# Altium schematic sheet BMS_Balancing.SchDoc
size 431 x 279 mm; SheetNumber: 5; SheetTotal: 6
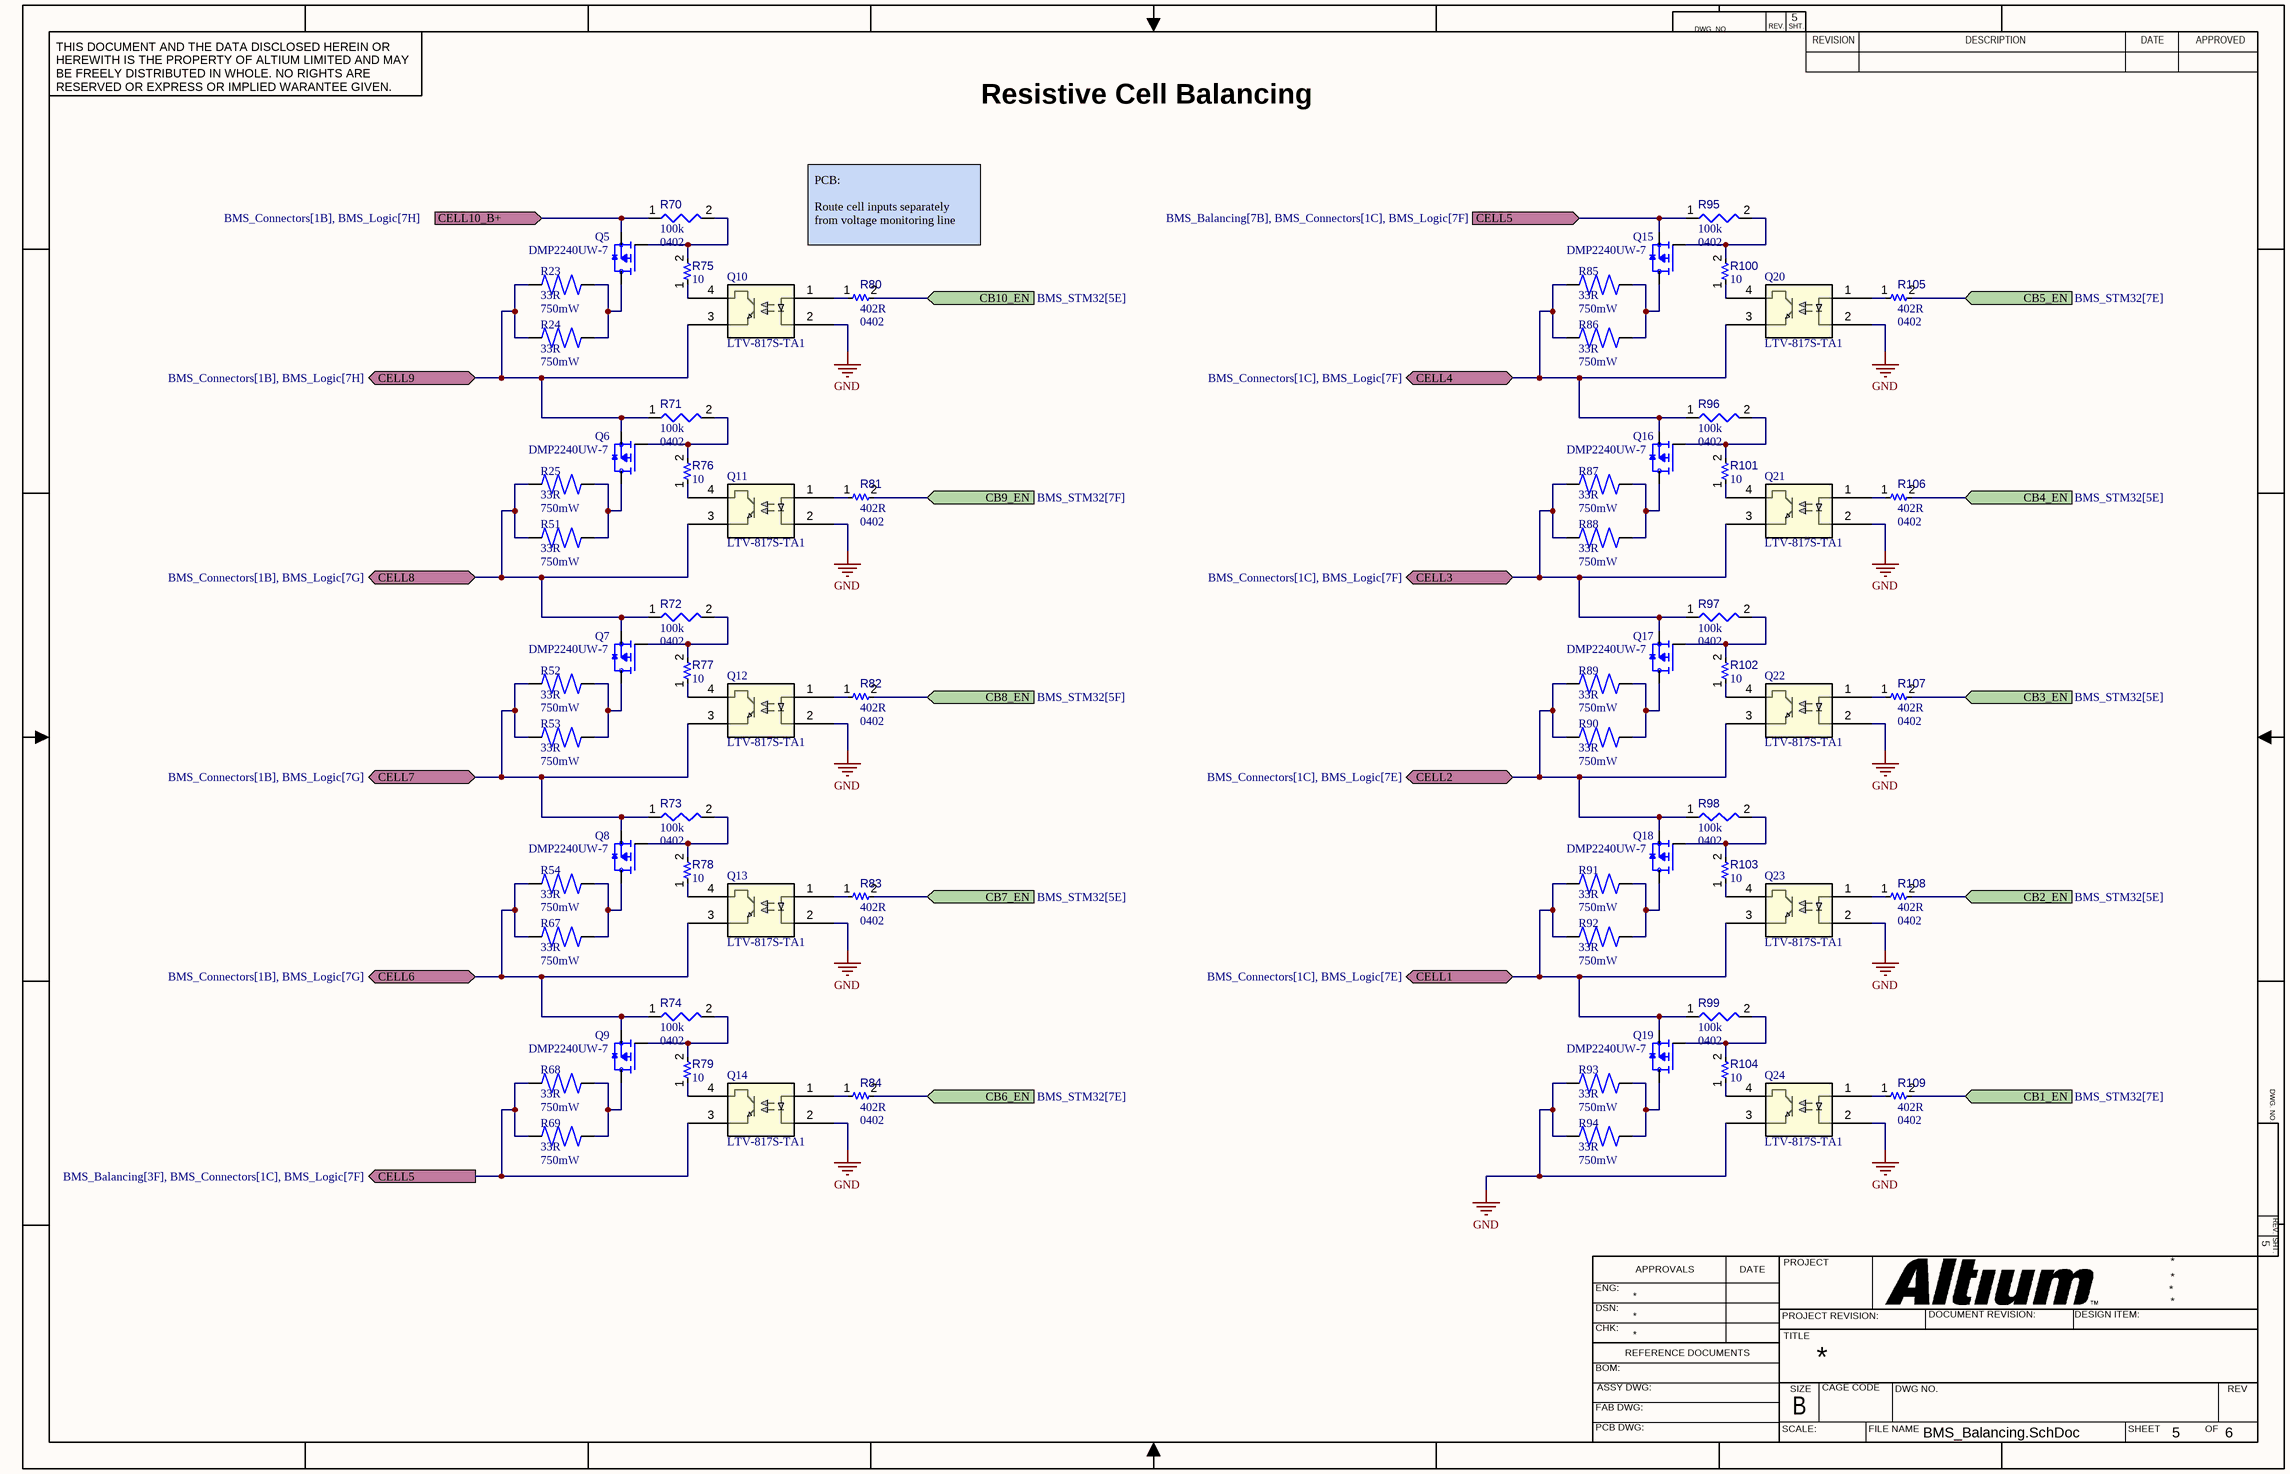
[diagram p0: BMS_Balancing.SchDoc]

## Parts
Q5  DMP2240UW-7  [SOT65P210X110-3N]
Q6  DMP2240UW-7  [SOT65P210X110-3N]
Q7  DMP2240UW-7  [SOT65P210X110-3N]
Q8  DMP2240UW-7  [SOT65P210X110-3N]
Q9  DMP2240UW-7  [SOT65P210X110-3N]
Q10  LTV-817S-TA1  [LTV-817S_LTO]
Q11  LTV-817S-TA1  [LTV-817S_LTO]
Q12  LTV-817S-TA1  [LTV-817S_LTO]
Q13  LTV-817S-TA1  [LTV-817S_LTO]
Q14  LTV-817S-TA1  [LTV-817S_LTO]
Q15  DMP2240UW-7  [SOT65P210X110-3N]
Q16  DMP2240UW-7  [SOT65P210X110-3N]
Q17  DMP2240UW-7  [SOT65P210X110-3N]
Q18  DMP2240UW-7  [SOT65P210X110-3N]
Q19  DMP2240UW-7  [SOT65P210X110-3N]
Q20  LTV-817S-TA1  [LTV-817S_LTO]
Q21  LTV-817S-TA1  [LTV-817S_LTO]
Q22  LTV-817S-TA1  [LTV-817S_LTO]
Q23  LTV-817S-TA1  [LTV-817S_LTO]
Q24  LTV-817S-TA1  [LTV-817S_LTO]
R23  value 33R  Power: 750mW  [RESC1632X70N]  (hidden comment: YAGEO AC0612FR-0733RL)
R24  value 33R  Power: 750mW  [RESC1632X70N]  (hidden comment: YAGEO AC0612FR-0733RL)
R25  value 33R  Power: 750mW  [RESC1632X70N]  (hidden comment: YAGEO AC0612FR-0733RL)
R51  value 33R  Power: 750mW  [RESC1632X70N]  (hidden comment: YAGEO AC0612FR-0733RL)
R52  value 33R  Power: 750mW  [RESC1632X70N]  (hidden comment: YAGEO AC0612FR-0733RL)
R53  value 33R  Power: 750mW  [RESC1632X70N]  (hidden comment: YAGEO AC0612FR-0733RL)
R54  value 33R  Power: 750mW  [RESC1632X70N]  (hidden comment: YAGEO AC0612FR-0733RL)
R67  value 33R  Power: 750mW  [RESC1632X70N]  (hidden comment: YAGEO AC0612FR-0733RL)
R68  value 33R  Power: 750mW  [RESC1632X70N]  (hidden comment: YAGEO AC0612FR-0733RL)
R69  value 33R  Power: 750mW  [RESC1632X70N]  (hidden comment: YAGEO AC0612FR-0733RL)
R70  value 100k  Case/Package: 0402  [RESC0402(1005)_L]  (hidden comment: CRCW0402100KJNED)
R71  value 100k  Case/Package: 0402  [RESC0402(1005)_L]  (hidden comment: CRCW0402100KJNED)
R72  value 100k  Case/Package: 0402  [RESC0402(1005)_L]  (hidden comment: CRCW0402100KJNED)
R73  value 100k  Case/Package: 0402  [RESC0402(1005)_L]  (hidden comment: CRCW0402100KJNED)
R74  value 100k  Case/Package: 0402  [RESC0402(1005)_L]  (hidden comment: CRCW0402100KJNED)
R75  value 10  [RESC0402(1005)_L]  (hidden comment: CL0402FN10RP)
R76  value 10  [RESC0402(1005)_L]  (hidden comment: CL0402FN10RP)
R77  value 10  [RESC0402(1005)_L]  (hidden comment: CL0402FN10RP)
R78  value 10  [RESC0402(1005)_L]  (hidden comment: CL0402FN10RP)
R79  value 10  [RESC0402(1005)_L]  (hidden comment: CL0402FN10RP)
R80  value 402R  Case/Package: 0402  [RESC0402(1005)_L]  (hidden comment: CR0402FF4020G)
R81  value 402R  Case/Package: 0402  [RESC0402(1005)_L]  (hidden comment: CR0402FF4020G)
R82  value 402R  Case/Package: 0402  [RESC0402(1005)_L]  (hidden comment: CR0402FF4020G)
R83  value 402R  Case/Package: 0402  [RESC0402(1005)_L]  (hidden comment: CR0402FF4020G)
R84  value 402R  Case/Package: 0402  [RESC0402(1005)_L]  (hidden comment: CR0402FF4020G)
R85  value 33R  Power: 750mW  [RESC1632X70N]  (hidden comment: YAGEO AC0612FR-0733RL)
R86  value 33R  Power: 750mW  [RESC1632X70N]  (hidden comment: YAGEO AC0612FR-0733RL)
R87  value 33R  Power: 750mW  [RESC1632X70N]  (hidden comment: YAGEO AC0612FR-0733RL)
R88  value 33R  Power: 750mW  [RESC1632X70N]  (hidden comment: YAGEO AC0612FR-0733RL)
R89  value 33R  Power: 750mW  [RESC1632X70N]  (hidden comment: YAGEO AC0612FR-0733RL)
R90  value 33R  Power: 750mW  [RESC1632X70N]  (hidden comment: YAGEO AC0612FR-0733RL)
R91  value 33R  Power: 750mW  [RESC1632X70N]  (hidden comment: YAGEO AC0612FR-0733RL)
R92  value 33R  Power: 750mW  [RESC1632X70N]  (hidden comment: YAGEO AC0612FR-0733RL)
R93  value 33R  Power: 750mW  [RESC1632X70N]  (hidden comment: YAGEO AC0612FR-0733RL)
R94  value 33R  Power: 750mW  [RESC1632X70N]  (hidden comment: YAGEO AC0612FR-0733RL)
R95  value 100k  Case/Package: 0402  [RESC0402(1005)_L]  (hidden comment: CRCW0402100KJNED)
R96  value 100k  Case/Package: 0402  [RESC0402(1005)_L]  (hidden comment: CRCW0402100KJNED)
R97  value 100k  Case/Package: 0402  [RESC0402(1005)_L]  (hidden comment: CRCW0402100KJNED)
R98  value 100k  Case/Package: 0402  [RESC0402(1005)_L]  (hidden comment: CRCW0402100KJNED)
R99  value 100k  Case/Package: 0402  [RESC0402(1005)_L]  (hidden comment: CRCW0402100KJNED)
R100  value 10  [RESC0402(1005)_L]  (hidden comment: CL0402FN10RP)
R101  value 10  [RESC0402(1005)_L]  (hidden comment: CL0402FN10RP)
R102  value 10  [RESC0402(1005)_L]  (hidden comment: CL0402FN10RP)
R103  value 10  [RESC0402(1005)_L]  (hidden comment: CL0402FN10RP)
R104  value 10  [RESC0402(1005)_L]  (hidden comment: CL0402FN10RP)
R105  value 402R  Case/Package: 0402  [RESC0402(1005)_L]  (hidden comment: CR0402FF4020G)
R106  value 402R  Case/Package: 0402  [RESC0402(1005)_L]  (hidden comment: CR0402FF4020G)
R107  value 402R  Case/Package: 0402  [RESC0402(1005)_L]  (hidden comment: CR0402FF4020G)
R108  value 402R  Case/Package: 0402  [RESC0402(1005)_L]  (hidden comment: CR0402FF4020G)
R109  value 402R  Case/Package: 0402  [RESC0402(1005)_L]  (hidden comment: CR0402FF4020G)

## Ports
CB1_EN (in, see BMS_STM32[7E]), CB2_EN (in, see BMS_STM32[5E]), CB3_EN (in, see BMS_STM32[5E]), CB4_EN (in, see BMS_STM32[5E]), CB5_EN (in, see BMS_STM32[7E]), CB6_EN (in, see BMS_STM32[7E]), CB7_EN (in, see BMS_STM32[5E]), CB8_EN (in, see BMS_STM32[5F]), CB9_EN (in, see BMS_STM32[7F]), CB10_EN (in, see BMS_STM32[5E]), CELL1 (bidir, see BMS_Connectors[1C], BMS_Logic[7E]), CELL2 (bidir, see BMS_Connectors[1C], BMS_Logic[7E]), CELL3 (bidir, see BMS_Connectors[1C], BMS_Logic[7F]), CELL4 (bidir, see BMS_Connectors[1C], BMS_Logic[7F]), CELL5 (in, see BMS_Balancing[7B], BMS_Connectors[1C], BMS_Logic[7F]), CELL5 (out, see BMS_Balancing[3F], BMS_Connectors[1C], BMS_Logic[7F]), CELL6 (bidir, see BMS_Connectors[1B], BMS_Logic[7G]), CELL7 (bidir, see BMS_Connectors[1B], BMS_Logic[7G]), CELL8 (bidir, see BMS_Connectors[1B], BMS_Logic[7G]), CELL9 (bidir, see BMS_Connectors[1B], BMS_Logic[7H]), CELL10_B+ (in, see BMS_Connectors[1B], BMS_Logic[7H])

## Nets
GND: Q10.2 Q11.2 Q12.2 Q13.2 Q14.2 Q20.2 Q21.2 Q22.2 Q23.2 Q24.2 Q24.3 R93.1 R94.1
CB1_EN: R109.2 ; port CB1_EN
CB2_EN: R108.2 ; port CB2_EN
CB3_EN: R107.2 ; port CB3_EN
CB4_EN: R106.2 ; port CB4_EN
CB5_EN: R105.2 ; port CB5_EN
CB6_EN: R84.2 ; port CB6_EN
CB7_EN: R83.2 ; port CB7_EN
CB8_EN: R82.2 ; port CB8_EN
CB9_EN: R81.2 ; port CB9_EN
CB10_EN: R80.2 ; port CB10_EN
CELL1: Q19.2(S) Q23.3 R91.1 R92.1 R99.1 ; port CELL1
CELL2: Q18.2(S) Q22.3 R89.1 R90.1 R98.1 ; port CELL2
CELL3: Q17.2(S) Q21.3 R87.1 R88.1 R97.1 ; port CELL3
CELL4: Q16.2(S) Q20.3 R85.1 R86.1 R96.1 ; port CELL4
CELL5: Q14.3 Q15.2(S) R68.1 R69.1 R95.1 ; port CELL5
CELL6: Q9.2(S) Q13.3 R54.1 R67.1 R74.1 ; port CELL6
CELL7: Q8.2(S) Q12.3 R52.1 R53.1 R73.1 ; port CELL7
CELL8: Q7.2(S) Q11.3 R25.1 R51.1 R72.1 ; port CELL8
CELL9: Q6.2(S) Q10.3 R23.1 R24.1 R71.1 ; port CELL9
CELL10_B+: Q5.2(S) R70.1 ; port CELL10_B+
NetQ5_1: Q5.1(G) R70.2 R75.2
NetQ5_3: Q5.3(D) R23.2 R24.2
NetQ6_1: Q6.1(G) R71.2 R76.2
NetQ6_3: Q6.3(D) R25.2 R51.2
NetQ7_1: Q7.1(G) R72.2 R77.2
NetQ7_3: Q7.3(D) R52.2 R53.2
NetQ8_1: Q8.1(G) R73.2 R78.2
NetQ8_3: Q8.3(D) R54.2 R67.2
NetQ9_1: Q9.1(G) R74.2 R79.2
NetQ9_3: Q9.3(D) R68.2 R69.2
NetQ10_1: Q10.1 R80.1
NetQ10_4: Q10.4 R75.1
NetQ11_1: Q11.1 R81.1
NetQ11_4: Q11.4 R76.1
NetQ12_1: Q12.1 R82.1
NetQ12_4: Q12.4 R77.1
NetQ13_1: Q13.1 R83.1
NetQ13_4: Q13.4 R78.1
NetQ14_1: Q14.1 R84.1
NetQ14_4: Q14.4 R79.1
NetQ15_1: Q15.1(G) R95.2 R100.2
NetQ15_3: Q15.3(D) R85.2 R86.2
NetQ16_1: Q16.1(G) R96.2 R101.2
NetQ16_3: Q16.3(D) R87.2 R88.2
NetQ17_1: Q17.1(G) R97.2 R102.2
NetQ17_3: Q17.3(D) R89.2 R90.2
NetQ18_1: Q18.1(G) R98.2 R103.2
NetQ18_3: Q18.3(D) R91.2 R92.2
NetQ19_1: Q19.1(G) R99.2 R104.2
NetQ19_3: Q19.3(D) R93.2 R94.2
NetQ20_1: Q20.1 R105.1
NetQ20_4: Q20.4 R100.1
NetQ21_1: Q21.1 R106.1
NetQ21_4: Q21.4 R101.1
NetQ22_1: Q22.1 R107.1
NetQ22_4: Q22.4 R102.1
NetQ23_1: Q23.1 R108.1
NetQ23_4: Q23.4 R103.1
NetQ24_1: Q24.1 R109.1
NetQ24_4: Q24.4 R104.1

## Notes on the sheet
- Resistive Cell Balancing
- PCB:
  Route cell inputs separately from voltage monitoring line
- DWG. NO.
- REV.
- SHT.
- THIS DOCUMENT AND THE DATA DISCLOSED HEREIN OR HEREWITH IS THE PROPERTY OF ALTIUM LIMITED AND MAY BE FREELY DISTRIBUTED IN WHOLE. NO RIGHTS ARE RESERVED OR EXPRESS OR IMPLIED WARANTEE GIVEN.
- REVISION
- DESCRIPTION
- DATE
- APPROVED
- ENG:
- APPROVALS
- PROJECT
- DSN:
- CHK:
- REFERENCE DOCUMENTS
- PROJECT REVISION:
- TITLE
- DOCUMENT REVISION:
- DESIGN ITEM:
- BOM:
- FAB DWG:
- PCB DWG:
- ASSY DWG:
- SCALE:
- SIZE
- B
- CAGE CODE
- FILE NAME
- DWG NO.
- SHEET
- OF
- REV

## Library data of the parts
Q5-Q9 Q15-Q19 = CMP-147-000000-1: P-Channel Enhancement FET SOT-323; MF: Diodes Inc.; Package: SOT-323 Diodes Inc.; SnapEDA_Link: https://www.snapeda.com/parts/DMP2240UW-7/Diodes+Inc./view-part/?ref=snap; Check_prices: https://www.snapeda.com/parts/DMP2240UW-7/Diodes+Inc./view-part/?ref=eda; Value: *; Pin Count: 3; Source: DMP2240UW-7.SchLib; MP: DMP2240UW-7; Component Type: Standard; Design Item ID: DMP2240UW-7
Q10-Q14 Q20-Q24 = CMP-143-000000-2: No Description Available; Manufacturer_Name: LITE-ON; Source: LTV-817S-TA1.SchLib; RefDes: RefDes; Design Item ID: LTV-817S-TA1; Copyright: Copyright (C) 2025 Ultra Librarian. All rights reserved.; Type: Type; Manufacturer_Part_Number: LTV-817S-TA1
R23-R25 R51-R54 R67-R69 R85-R94 = CMP-009-00178-3: 750 mOhms Â±1% 1W Chip Resistor 0612 (1632 Metric) Automotive AEC-Q200, Current Sense, Moisture Resistant Thick Film; MF: Vishay Dale; Case/Package: 1632 Vishay; SnapEDA_Link: https://www.snapeda.com/parts/RCWE0612R750FKEA/Vishay+Dale/view-part/?ref=snap; Check_prices: https://www.snapeda.com/parts/RCWE0612R750FKEA/Vishay+Dale/view-part/?ref=eda; Source: RCWE0612R750FKEA.SchLib; MP: RCWE0612R750FKEA; Design Item ID: RCWE0612R750FKEA
R70-R74 R95-R99 = CMP-009-00064-2: 100K 0.063W 1% 0402 (1005 Metric)  SMD; Power: 63mW; Mounting Technology: SMT; Pins: 2; Tolerance: 1%
R75-R84 R100-R109 = CMP-009-00065-4: 100R 0.063W 1% 0402 (1005 Metric)  SMD; Power: 63mW; Tolerance: 1%; Pins: 2; Mounting Technology: SMT
  R75-R79 R100-R104: Case/Package: 0402